# EAGLE design lit-bit (EAGLE 9.0.1)
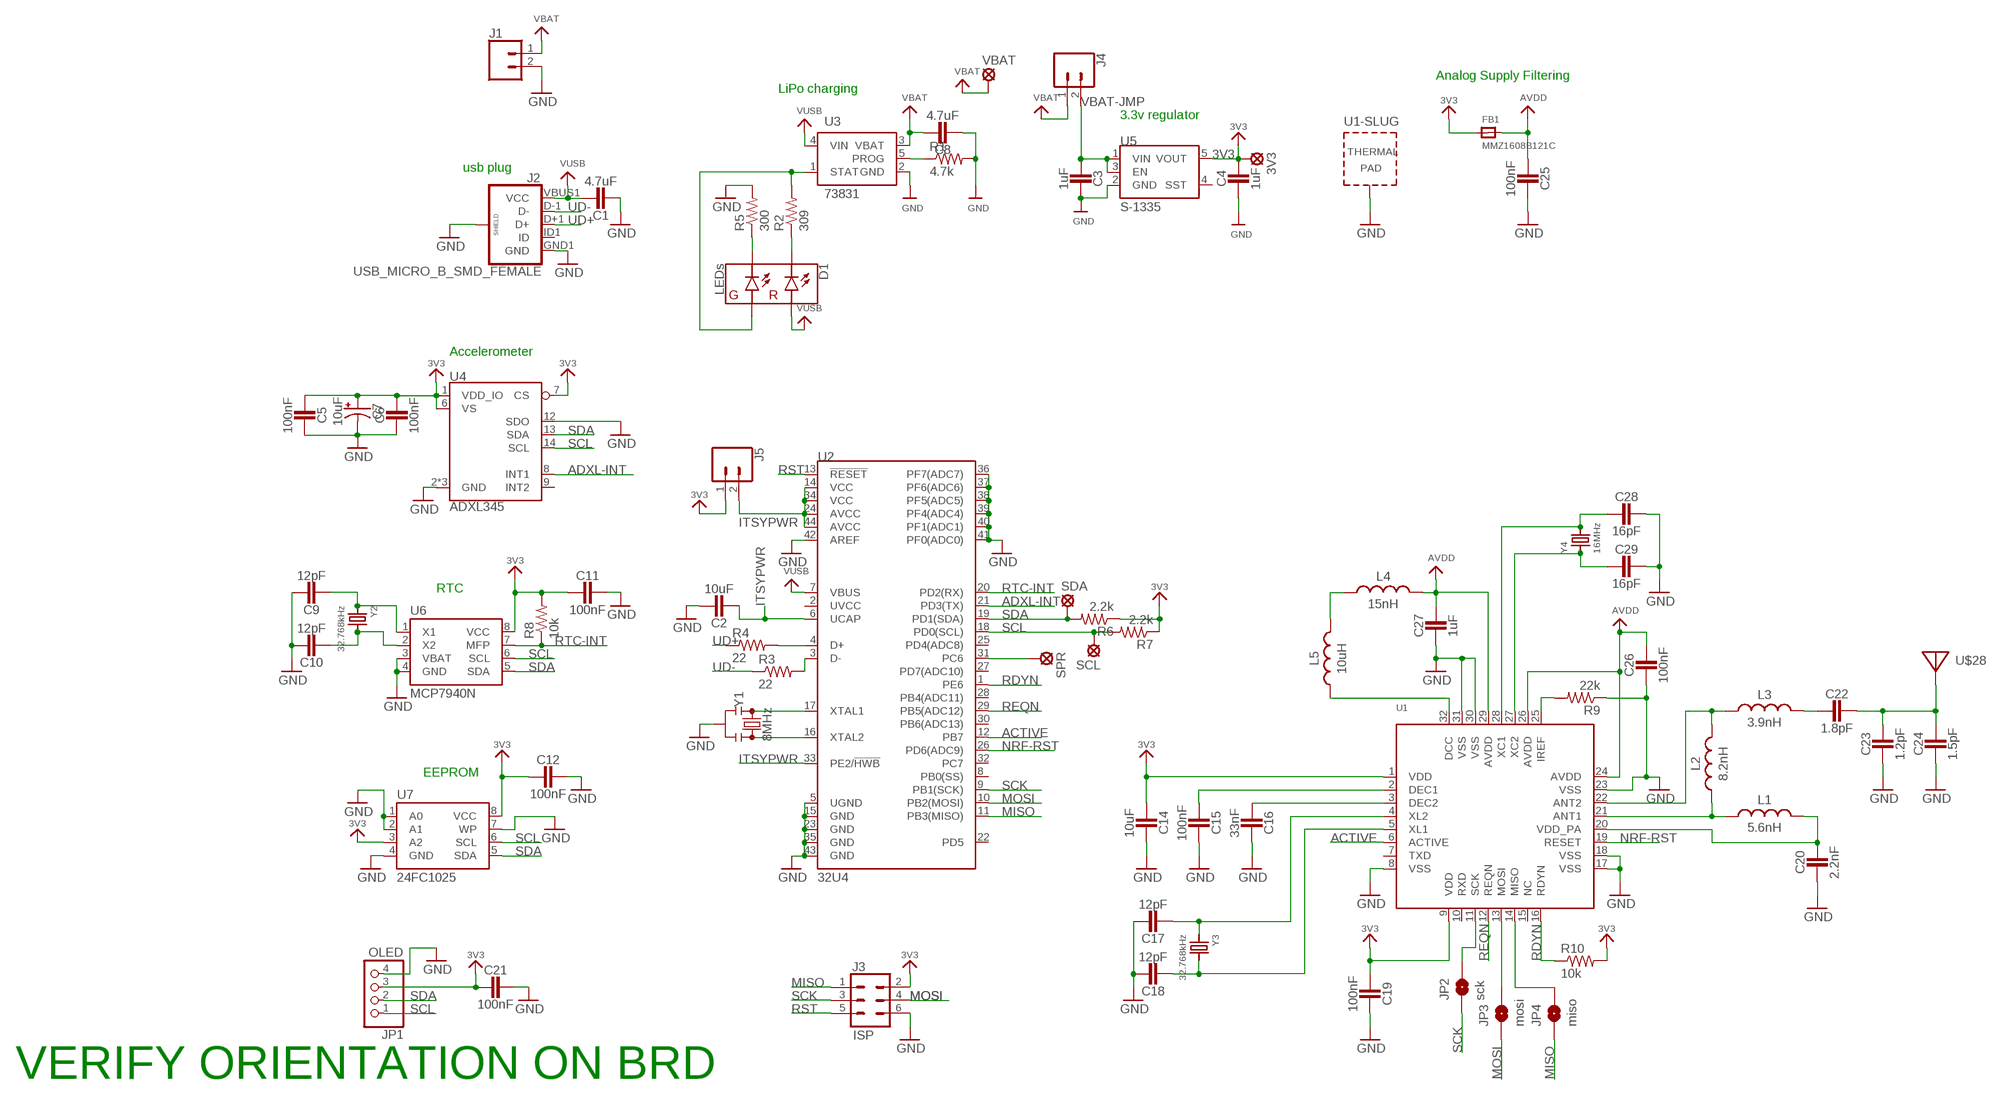
[diagram p0: schematic, sheet 1]

## Parts
3V3  LSP10  [LSP10]
C1  4.7uF  CAP_NONPOL0603  [0603]
C2  10uF  CAP_NONPOL0603  [0603]
C3  1uF  CAP_NONPOL0603  [0603]
C4  1uF  CAP_NONPOL0603  [0603]
C5  100nF  CAP_NONPOL0603  [0603]
C6  100nF  CAP_NONPOL0603  [0603]
C7  10uF  CAP_POL  [0805-POLAR]
C8  4.7uF  CAP_NONPOL0603  [0603]
C9  12pF  CAP_NONPOL0603  [0603]
C10  12pF  CAP_NONPOL0603  [0603]
C11  100nF  CAP_NONPOL0603  [0603]
C12  100nF  CAP_NONPOL0603  [0603]
C14  10uF  CAP_NONPOL0603  [0603]
C15  100nF  CAP_NONPOL0603  [0603]
C16  33nF  CAP_NONPOL0603  [0603]
C17  12pF  CAP_NONPOL0603  [0603]
C18  12pF  CAP_NONPOL0603  [0603]
C19  100nF  CAP_NONPOL0603  [0603]
C20  2.2nF  CAP_NONPOL0603  [0603]
C21  100nF  CAP_NONPOL0603  [0603]
C22  1.8pF  CAP_NONPOL0603  [0603]
C23  1.2pF  CAP_NONPOL0603  [0603]
C24  1.5pF  CAP_NONPOL0603  [0603]
C25  100nF  CAP_NONPOL0603  [0603]
C26  100nF  CAP_NONPOL0603  [0603]
C27  1uF  CAP_NONPOL0603  [0603]
C28  16pF  CAP_NONPOL0603  [0603]
C29  16pF  CAP_NONPOL0603  [0603]
D1  LEDs  LED-RGSMIT  [0606]
FB1  MMZ1608B121C  FERRITE0805  [0805]
J1  CONN_02-JST-2MM-SMT  [JST-2-SMD]
J2  USB_MICRO_B_SMD_FEMALE  [USB-B-MICRO-SMD]
J3  ISP  CONN_03X22X3_SILK_MALE_PTH  [2X3]
J4  CONN_02  [1X02]
J5  CONN_02  [1X02]
JP1  OLED  HEADER-1X4ROUND  [1X04_ROUND]
JP2  sck  JUMPER-SMT_2_NO_SILK  [SMT-JUMPER_2_NO_SILK]
JP3  mosi  JUMPER-SMT_2_NO_SILK  [SMT-JUMPER_2_NO_SILK]
JP4  miso  JUMPER-SMT_2_NO_SILK  [SMT-JUMPER_2_NO_SILK]
L1  5.6nH  INDUCTOR0603  [0603]
L2  8.2nH  INDUCTOR0603  [0603]
L3  3.9nH  INDUCTOR0603  [0603]
L4  15nH  INDUCTOR0603  [0603]
L5  10uH  INDUCTOR0603  [0603]
R1  4.7k  RES-0603  [0603]
R2  309  RES-0603  [0603]
R3  22  RES-0603  [0603]
R4  22  RES-0603  [0603]
R5  300  RES-0603  [0603]
R6  2.2k  RES-0603  [0603]
R7  2.2k  RES-0603  [0603]
R8  10k  RES-0603  [0603]
R9  22k  RES-0603  [0603]
R10  10k  RES-0603  [0603]
SCL  LSP10  [LSP10]
SDA  LSP10  [LSP10]
SPR  LSP10  [LSP10]
U1  NRF8001  [QFN32_5MM]
U2  32U4  ATMEGA32U4TQFP-44  [TQFP44]
U3  73831  MCP73831T  [SOT23-5]
U4  ADXL345  [LGA-14]
U5  S-1335  S-1335M33  [SOT23-5]
U6  MCP7940N  [8-SOIC_HAND_SOLDER]
U7  24FC1025  [8-SOIC_HAND_SOLDER]
U$28  ANTENNA_PCBNRF8001_1.6MM  [ANT_PCB_2.4GHZ_NRF8001_1.6MM_1OZ]
VBAT  LSP10  [LSP10]
Y1  8MHz  RESONATOR-8MHZSMD_3.2X1.3  [RESONATOR-SMD-3.2X1.3]
Y2  32.768kHz  CRYSTAL8X3.8SMT  [CRYSTAL_8X3.8]
Y3  32.768kHz  CRYSTAL8X3.8SMT  [CRYSTAL_8X3.8]
Y4  16MHz  CRYSTALTHIN  [CRYSTAL_3.2X2.5]

## Nets
3V3: 3V3.MP C4.1 C5.2 C6.1 C7.1(+) C11.2 C12.2 C14.2 C19.2 C21.2 FB1.1 J3.2 J5.1 JP1.3 R6.1 R7.1 R8.2 R10.2 U1.1(VDD) U1.9(VDD) U4.1(VDD_IO) U4.6(VS) U4.7(CS) U5.5(VOUT) U6.8(VCC) U7.3(A2) U7.8(VCC)
ACTIVE: U1.6(ACTIVE) U2.12(PB7)
ADXL-INT: U2.21(PD3(TX)) U4.8(INT1)
AVDD: C25.2 C26.1 C27.1 FB1.2 L4.2 U1.24(AVDD) U1.26(AVDD) U1.29(AVDD)
D+: R4.2 U2.4(D+)
GND: C1.2 C2.1 C3.1 C4.2 C5.1 C6.2 C7.2(-) C8.2 C9.1 C10.1 C11.1 C12.1 C14.1 C15.1 C16.1 C17.1 C18.1 C19.1 C20.2 C21.1 C23.2 C24.2 C25.1 C26.2 C27.2 C28.1 C29.1 J1.2 J2.GND1(GND) J2.P$1(SHIELD) J2.P$3(SHIELD) J2.P$4(SHIELD) J2.P$5(SHIELD) J3.6 JP1.4 R1.2 R5.2 R9.1 U1.8(VSS) U1.17(VSS) U1.18(VSS) U1.23(VSS) U1.30(VSS) U1.31(VSS) U1.33(TP) U2.5(UGND) U2.15(GND) U2.23(GND) U2.35(GND) U2.36(PF7(ADC7)) U2.37(PF6(ADC6)) U2.38(PF5(ADC5)) U2.39(PF4(ADC4)) U2.40(PF1(ADC1)) U2.41(PF0(ADC0)) U2.42(AREF) U2.43(GND) U3.2(GND) U4.2(GND) U4.4(GND) U4.5(GND) U4.12(SDO) U5.2(GND) U6.3(VBAT) U6.4(GND) U7.1(A0) U7.2(A1) U7.4(GND) U7.7(WP) Y1.2
ITSYPWR [3v3]: C2.2 J5.2 U2.6(UCAP) U2.14(VCC) U2.24(AVCC) U2.33(PE2/!HWB) U2.34(VCC) U2.44(AVCC)
MISO: J3.1 JP4.1 U2.11(PB3(MISO))
MOSI: J3.4 JP3.1 U2.10(PB2(MOSI))
N$1: U2.17(XTAL1) Y1.1
N$2: R1.1 U3.5(PROG)
N$3: D1.P$3(GA) R2.2 U3.1(STAT)
N$4: D1.P$2(RC) R2.1
N$5: D1.P$4(GC) R5.1
N$6: R3.2 U2.3(D-)
N$7: U2.16(XTAL2) Y1.3
N$9: SPR.MP U2.31(PC6)
N$15: C17.2 U1.4(XL2) Y3.P$1
N$16: C15.2 U1.2(DEC1)
N$20: C9.2 U6.1(X1) Y2.P$1
N$21: C10.2 U6.2(X2) Y2.P$4
N$22: C16.2 U1.3(DEC2)
N$23: C18.2 U1.5(XL1) Y3.P$4
N$24: C20.1 L1.2 U1.20(VDD_PA)
N$25: L1.1 L2.1 U1.21(ANT1)
N$27: JP2.2 U1.11(SCK)
N$28: L2.2 L3.1 U1.22(ANT2)
N$29: JP3.2 U1.13(MOSI)
N$30: R9.2 U1.25(IREF)
N$31: C22.2 L3.2
N$32: C22.1 C23.1 C24.1 U$28.FEED
N$33: C28.2 U1.28(XC1) Y4.2
N$34: JP4.2 U1.14(MISO)
N$35: L4.1 L5.2
N$36: L5.1 U1.32(DCC)
N$37: C29.2 U1.27(XC2) Y4.1
NRF-RST: U1.19(RESET) U2.26(PD6(ADC9))
RDYN: R10.1 U1.16(RDYN) U2.1(PE6)
REQN: U1.12(REQN) U2.29(PB5(ADC12))
RST: J3.5 U2.13(!RESET)
RTC-INT: R8.1 U2.20(PD2(RX)) U6.7(MFP)
SCK: J3.3 JP2.1 U2.9(PB1(SCK))
SCL: JP1.1 R7.2 SCL.MP U2.18(PD0(SCL)) U4.14(SCL) U6.6(SCL) U7.6(SCL)
SDA: JP1.2 R6.2 SDA.MP U2.19(PD1(SDA)) U4.13(SDA) U6.5(SDA) U7.5(SDA)
UD+: J2.D+1(D+) R4.1
UD-: J2.D-1(D-) R3.1
VBAT [VBAT]: C8.1 J1.1 J4.1 U3.3(VBAT) VBAT.MP
VBAT-JMP [VBAT]: C3.2 J4.2 U5.1(VIN) U5.3(EN)
VUSB: C1.1 D1.P$1(RA) J2.VBUS1(VCC) U2.7(VBUS) U3.4(VIN)
Unconnected: J2.ID1(ID) U1.7(TXD) U1.10(RXD) U1.15(NC) U2.2(UVCC) U2.8(PB0(SS)) U2.22(PD5) U2.25(PD4(ADC8)) U2.27(PD7(ADC10)) U2.28(PB4(ADC11)) U2.30(PB6(ADC13)) U2.32(PC7) U4.9(INT2) U5.4(SST)

## Notes on the sheet
- Analog Supply Filtering
- LiPo charging
- 3.3v regulator
- usb plug
- Accelerometer
- RTC
- EEPROM
- VERIFY ORIENTATION ON BRD

## Library data of the parts
3V3 SCL SDA SPR VBAT = solpad:LSP10: SOLDER PAD drill 1.0 mm, distributor Buerklin, 12H555
C1-C6 C8-C12 C14-C29 = SCADA_CUSTOM_LIBRARY:CAP_NONPOL
C7 = SCADA_CUSTOM_LIBRARY:CAP_POL
D1 = SCADA_CUSTOM_LIBRARY:LED-RG: LiteOn Technology Corporation LTST-C195KGJRKT - LED GREEN/RED CLEAR 0606 SMD Color: Red/Green Lens Transparency: Clear Lens Style/Size: Rectangle with Flat top, 1.10 x 1.5 mm mC Rating45mcd Red, 35 mcd Green Current: 20mA Red, 20mA Green Forward Voltage: 2V Red, 2V Green Packages: 0606 SparkFun Products: Electric Imp imp002 Breakout <[https://www.sparkfun.com/products/12958]>; PROD_ID: DIO-12140
FB1 = microbuilder:FERRITE: Ferrite Bead 0603 MMZ1608B121C - 120 Ohm @ 100MHz, 600mA, 0.15 Ohm DC Resistance - Digikey: 445-2164-1-ND BK1608HW121-T - 120 Ohm, 600mA Ferrite Chip - Digikey: 587-1876-2-ND 0805 HZ0805B272R-10 - 2.7K Ohm @ 100MHz, 200mA, 0.8 Ohm DC Resistance - Digikey: 240-2504-1-ND (see also Murata BLM21BD272SN1L) MMZ2012Y152B - 1.5K Ohm @ 100MHz, 500mA, 0.4 Ohm DC Resistance - Digikey: 445-1560-1-ND - Mainly for high frequency (80-400MHz) MMZ2012R102A - 1K Ohm @ 100MHz, 500mA, 0.3 Ohm DC Resistance - Digikey: 445-1555-2-ND - More general purpose (10-200MHz)
J1 = SparkFun-Connectors:CONN_02: Multi connection point. Often used as Generic Header-pin footprint for 0.1 inch spaced/style header connections On any of the 0.1 inch spaced packages, you can populate with these: Break Away Headers - Straight <https://www.sparkfun.com/products/116> (PRT-00116) Break Away Male Headers - Right Angle <https://www.sparkfun.com/products/553> (PRT-00553) Female Headers <https://www.sparkfun.com/products/115> (PRT-00115) Break Away Headers - Machine Pin <https://www.sparkfun.com/products/117> (PRT-00117) Break Away Female Headers - Swiss Machine Pin <https://www.sparkfun.com/products/743> (PRT-00743) For SCREWTERMINALS and SPRING TERMINALS visit here: Screw Terimnals on SparkFun.com <https://www.sparkfun.com/search/results?term=Screw+Terminals> (5mm/3.5mm/2.54mm spacing) This device is also useful as a general connection point to wire up your design to another part of your project. Our various solder wires solder well into these plated through hole pads. Hook-Up Wire - Assortment (Stranded, 22 AWG) <https://www.sparkfun.com/products/11375> (PRT-11375) Hook-Up Wire - Assortment (Solid Core, 22 AWG) <https://www.sparkfun.com/products/11367> (PRT-11367) View the entire wire category on our website here <https://www.sparkfun.com/categories/141> Special notes: Molex polarized connector foot print use with: PRT-08233 with associated crimp pins and housings. 2.54_SCREWTERM for use with PRT-10571. 3.5mm Screw Terminal footprints for PRT-08084 5mm Screw Terminal footprints for use with PRT-08432; PROD_ID: CONN-11443
J2 = SCADA_CUSTOM_LIBRARY:USB_MICRO_B_SMD_FEMALE
J3 = SCADA_CUSTOM_LIBRARY:CONN_03X2: Multi connection point. Often used as Generic Header-pin footprint for 0.1 inch spaced/style header connections You can populate with any combo of single row headers, but if you'd like an exact match, check these: Header - 2x3 (Male, 0.1") <https://www.sparkfun.com/products/12807> (PRT-12807) Header - 2x3 (Female, 0.1") <https://www.sparkfun.com/products/13010> (PRT-13010) 2x3 Pin Shrouded Header <https://www.sparkfun.com/products/10877> (PRT-10877) On any of the 0.1 inch spaced packages, you can populate with these: Break Away Headers - Straight <https://www.sparkfun.com/products/116> (PRT-00116) Break Away Male Headers - Right Angle <https://www.sparkfun.com/products/553> (PRT-00553) Female Headers <https://www.sparkfun.com/products/115> (PRT-00115) Break Away Headers - Machine Pin <https://www.sparkfun.com/products/117> (PRT-00117) Break Away Female Headers - Swiss Machine Pin <https://www.sparkfun.com/products/743> (PRT-00743) Special note: the shrouded connector mates well with our 3x2 ribbon cables: Ribbon Crimp Connector - 6-pin (2x3, Female) <https://www.sparkfun.com/products/10651> (PRT-10651) Ribbon Cable - 6 wire (15ft) <https://www.sparkfun.com/products/10646> (PRT-10646); PROD_ID: CONN-09701
J4 J5 = SparkFun-Connectors:CONN_02: Multi connection point. Often used as Generic Header-pin footprint for 0.1 inch spaced/style header connections On any of the 0.1 inch spaced packages, you can populate with these: Break Away Headers - Straight <https://www.sparkfun.com/products/116> (PRT-00116) Break Away Male Headers - Right Angle <https://www.sparkfun.com/products/553> (PRT-00553) Female Headers <https://www.sparkfun.com/products/115> (PRT-00115) Break Away Headers - Machine Pin <https://www.sparkfun.com/products/117> (PRT-00117) Break Away Female Headers - Swiss Machine Pin <https://www.sparkfun.com/products/743> (PRT-00743) For SCREWTERMINALS and SPRING TERMINALS visit here: Screw Terimnals on SparkFun.com <https://www.sparkfun.com/search/results?term=Screw+Terminals> (5mm/3.5mm/2.54mm spacing) This device is also useful as a general connection point to wire up your design to another part of your project. Our various solder wires solder well into these plated through hole pads. Hook-Up Wire - Assortment (Stranded, 22 AWG) <https://www.sparkfun.com/products/11375> (PRT-11375) Hook-Up Wire - Assortment (Solid Core, 22 AWG) <https://www.sparkfun.com/products/11367> (PRT-11367) View the entire wire category on our website here <https://www.sparkfun.com/categories/141> Special notes: Molex polarized connector foot print use with: PRT-08233 with associated crimp pins and housings. 2.54_SCREWTERM for use with PRT-10571. 3.5mm Screw Terminal footprints for PRT-08084 5mm Screw Terminal footprints for use with PRT-08432
JP1 = microbuilder:HEADER-1X4: PIN HEADER
JP2-JP4 = SparkFun-Jumpers:JUMPER-SMT_2_NO: Normally open jumper This jumper has two pads in close proximity to each other. Apply solder to close the connection. Round pads are easier to solder for beginners, but are a lot larger. SparkFun Product that uses the round pads: SparkFun EL Sequencer <https://www.sparkfun.com/products/12781>
L1-L5 = SCADA_CUSTOM_LIBRARY:INDUCTOR
R1-R10 = SCADA_CUSTOM_LIBRARY:RES-0603
U1 = SCADA_CUSTOM_LIBRARY:NRF8001: nRF8001 - Bluetooth Low-Energy Transceiver VDD: 1.9-3.6V Temp: -40°C - 85°C
U2 = SCADA_CUSTOM_LIBRARY:ATMEGA32U4: Atmel MCU, 32KByte Atmel 44-pin 8-bit Microcontroller with 32KBytes of ISP Flash and USB Controller Datasheet <http://cdn.sparkfun.com/datasheets/Dev/Arduino/Boards/ATMega32U4.pdf> SparkFun Products LilyPad Arduino USB - ATmega32U4 Board <https://www.sparkfun.com/products/12049> (DEV-12049) Pro Micro - 5V/16MHz <https://www.sparkfun.com/products/12640> (DEV-12640) Pro Micro - 3.3V/8MHz <https://www.sparkfun.com/products/12587> (DEV-12587) Fio v3 - ATmega32U4 <https://www.sparkfun.com/products/11520> (DEV-11520) Qduino Mini <https://www.sparkfun.com/products/13614> (DEV-13614) Makey Makey - Standard Kit <https://www.sparkfun.com/products/11511> (WIG-11511) Makey Makey Deluxe Kit <https://www.sparkfun.com/products/11519> (WIG-11519); PROD_ID: IC-11161
U3 = SCADA_CUSTOM_LIBRARY:MCP73831T
U4 = SCADA_CUSTOM_LIBRARY:ADXL345: Analog Devices ADXL345 3-Axis SPI/I2C 2/4/8/16g Accelerometer The ADXL345 is a small, thin, low power, 3-axis accelerometer with high resolution (13-bit) measurement at up to ±16g. Digital output data is formatted as 16-bit twos complement and is accessible through either a SPI (3- or 4-wire) or I2C digital interface. Datasheet <https://www.sparkfun.com/datasheets/Sensors/Accelerometer/ADXL345.pdf> SparkFun Products SparkFun Triple Axis Accelerometer Breakout - ADXL345 <https://www.sparkfun.com/products/9836> (SEN-09836) Triple Axis Accelerometer - ADXL345 <https://www.sparkfun.com/products/9045> (SEN-09045) SparkFun 6 Degrees of Freedom IMU Digital Combo Board - ITG3200/ADXL345 <https://www.sparkfun.com/products/10121> (SEN-10121); PROD_ID: IC-09097; SF_ID: SEN-09045
U5 = SCADA_CUSTOM_LIBRARY:S-1335M33
U6 = SCADA_CUSTOM_LIBRARY:MCP7940N: RTC Battery-Backed I2C Real-Time Clock/Calendar with SRAM
U7 = SCADA_CUSTOM_LIBRARY:24FC1025
U$28 = microbuilder:ANTENNA_PCB: Various pre-calculated PCB Antennas NRF8001 1.6mm 1Oz - 2.4GHz PCB antenna for 1.6mm PCBs with 1oz copper, double-sided boards (no GND plan beneath antenna). See nRF2740 production files for further information and impedance matching network. 868MHz/2.4GHz DUALBAND - Dual 868MHz and 2.4GHz centered antenna based on board #6 of the CC-ANTENNA-DK from Chipcon/TI
Y1 = SCADA_CUSTOM_LIBRARY:RESONATOR-8MHZ: 8MHz Resonator Digikey Example <http://www.digikey.com/product-detail/en/murata-electronics-north-america/CSTCE10M0G55-R0/490-1196-1-ND/584633> Frequency: 8MHz Frequency Stability: ±0.2% Frequency Tolerance: ±0.5% Capacitance: 33pF SparkFun Products Arduino Pro Mini 328- 3.3V/8MHz <https://www.sparkfun.com/products/11114> SparkFun Digital Sandbox <https://www.sparkfun.com/products/12651>; PROD_ID: XTAL-08895
Y2-Y4 = SCADA_CUSTOM_LIBRARY:CRYSTAL: Crystals HC49UP - Surface Mount Crystal 4.0MHz 18pF +/-30ppm Surface Mount Crystal [Digikey: 535-9857-1-ND] 12.0 MHz Surface Mount Crystal [Digikey: 535-9869-6-ND] 25.0 MHz Surface Mount Crystal [Digikey: 535-9078-1-ND] 2.5 x 2.0mm - MEMs SMT Crystal 16.0 MHz 10pF 20ppm 2.5 x 2.0mm Crystal [Digikey -40-85°C: 535-10923-1-ND] 3.2 x 2.5mm - MEMs SMT Crystal 12.0 MHz 8pF 15ppm 3.2 x 2.5mm Crystal [Digikey: -10-70°C: 644-1047-1-ND -40-125°C: 644-1128-1-ND] 16.0 MHz 8pF 15ppm 3.2 x 2.5mm Crystal [Digikey: -10-70°C: 644-1049-1-ND -40-125°C: 644-1129-2-ND] 16.0 MHz 10pF 10ppm 3.2 x 2.5mm Crystal [Digikey: 644-1100-1-ND] 27.12 MHz 18pF 30ppm 3.2 x 2.5mm Crystal [Digikey: 887-1424-1-ND] 27.12MHz 10pF 10ppm 3.2 x 2.5mm Crystal [Digikey: 887-1329-1-ND] 4.9 x 1.8mm - MEMs SMT Crystal 32.768 KHz 12.5pF 20ppm 4.9 x 1.8mm Crystal [Digikey: SE2415CT-ND] 8.0 x 3.8mm - Surface Mount Crystal 32.768kHz 12.5pF 20ppm -40°C-85°C [Digikey: 535-9166-2-ND] Cylinder 32.768KHz Cylinder Crystal (2x6mm body) [Ex. Digikey: 300-8341-2-ND]

## Net classes
0 default: width 0.203 mm, clearance 0.205 mm
1 VBAT: width 0.381 mm, clearance 0.203 mm
2 3v3: width 0.381 mm

## Board
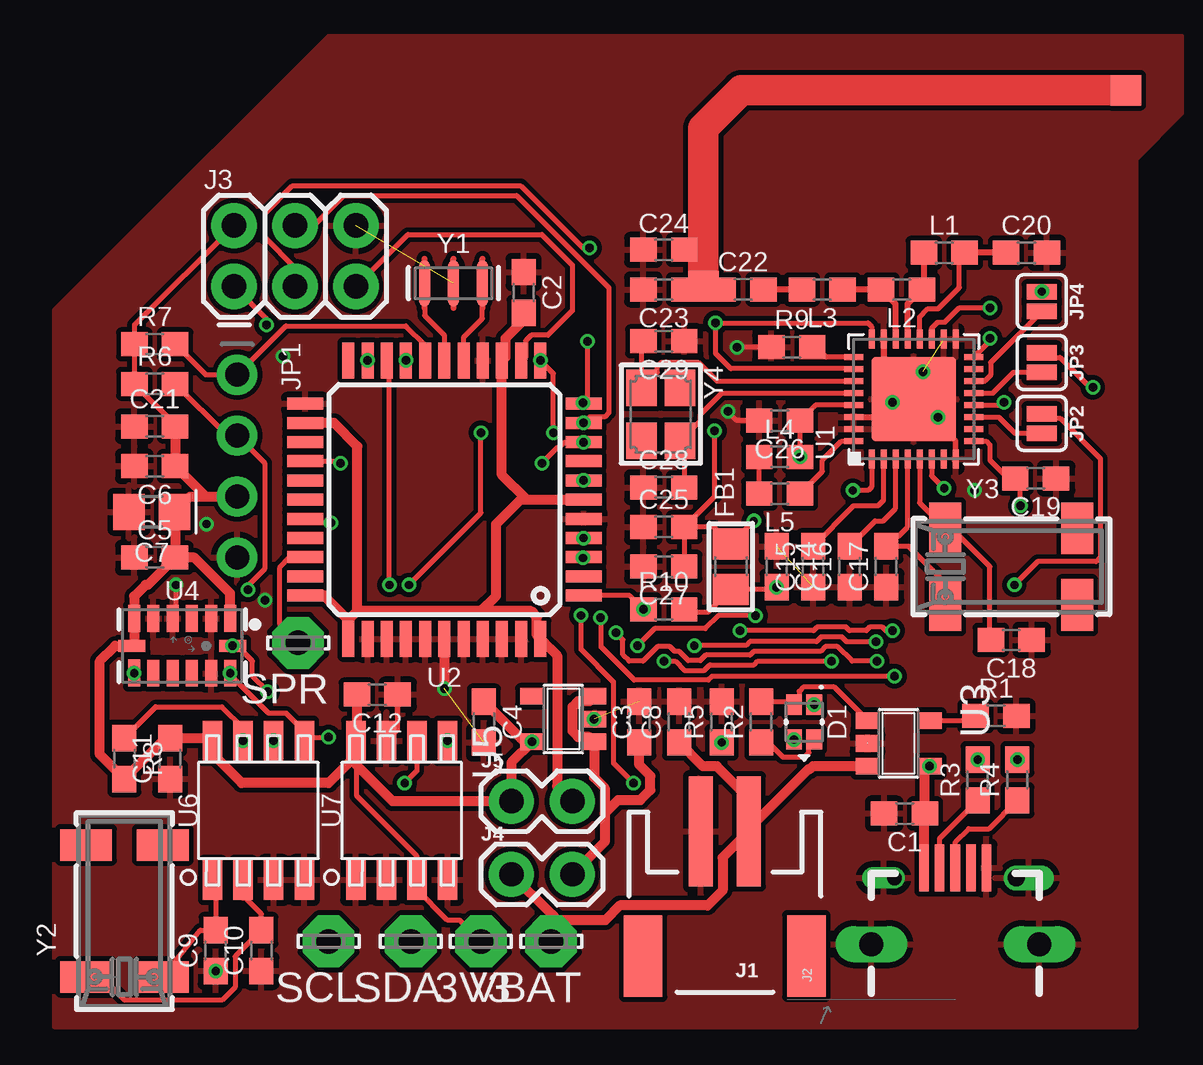
[diagram p1: board, top side]
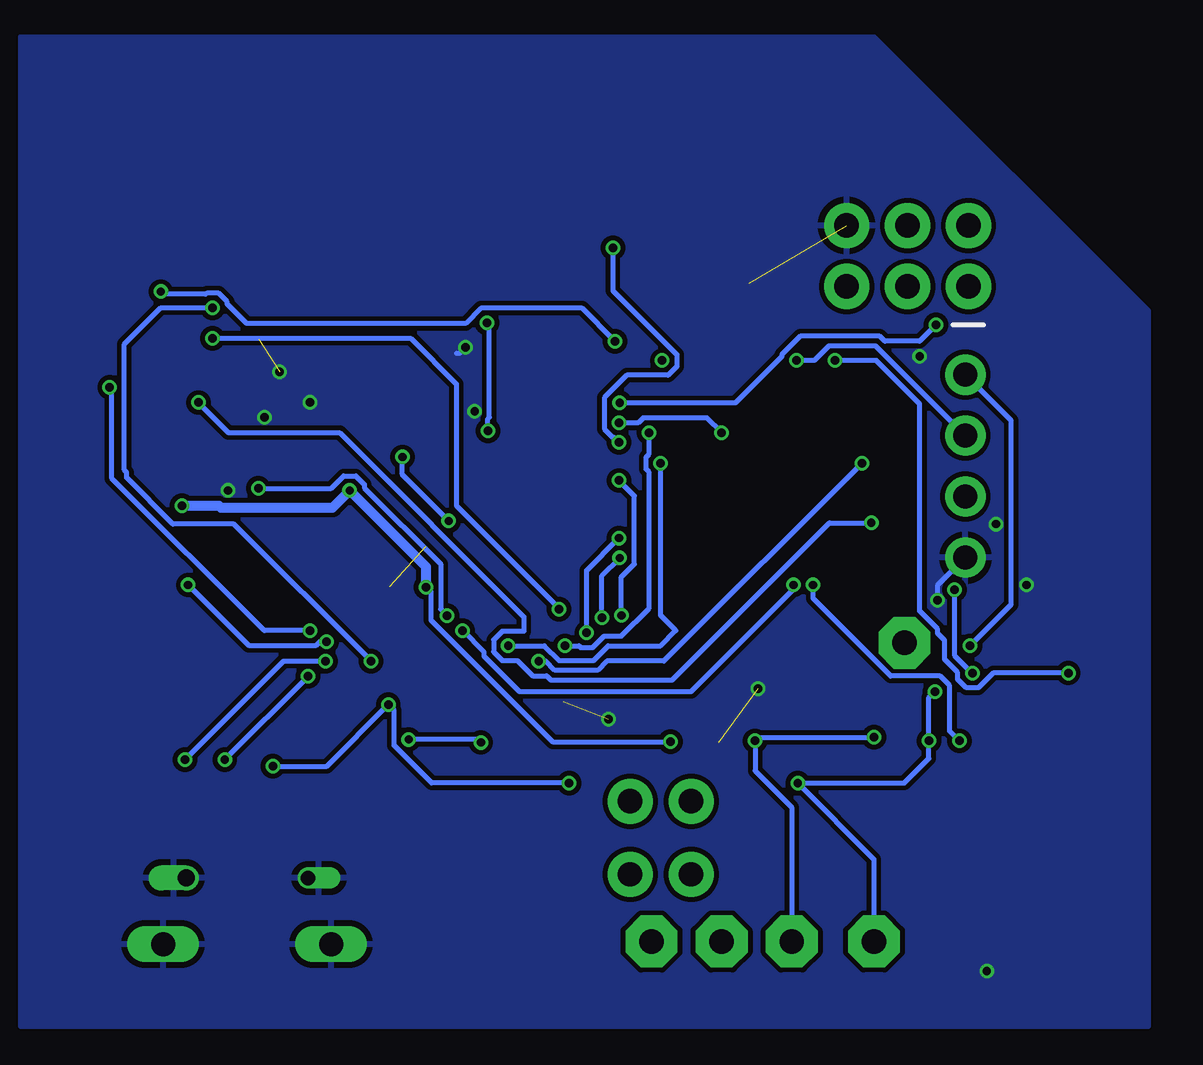
[diagram p2: board, bottom side, seen from below]

No outline drawn. Coordinates in mm, seen from the top.
Copper layers (1*16): Top 0.035559375mm / dielectric 1.6mm / Bottom 0.035559375mm
Design rules "oshpark-2layer *": minimum track width 6mil, minimum drill 10mil, track to track 6mil, track to pad 6mil, pad to pad 6mil, via to via 6mil, smd to smd 0mil, copper to edge 15mil, drill to drill 6mil, minimum pad ring 5mil, minimum via ring 5mil, stop-mask expansion 2.5mil, vias tented up to drill 0mil, thermal gap 10mil

### Footprints (pad centres in the part's own frame; a part is rotated, then mirrored left to right if it is on the bottom)
LSP10 = drill 1.016 pad 2.159 octagon: MP 0,0
0603 = smd 1.1 x 1: 1 -0.85,0; 2 0.85,0
0805-POLAR = smd 1.3 x 1.5: 1 -0.95,0; 2 0.95,0
0606 = smd 0.85 x 0.65: P$1 -0.725,0.425; P$2 0.725,0.425; P$3 -0.725,-0.425; P$4 0.725,-0.425
0805 = smd 1.3 x 1.5: 1 -0.95,0; 2 0.95,0
JST-2-SMD = smd 1 x 4.6: 1 -1,-3.7; 2 1,-3.7 | smd 1.6 x 3.4: NC1 -3.4,1.5; NC2 3.4,1.5
USB-B-MICRO-SMD = smd 1.958 x 0.4: D+1 5.345,3.73; D-1 5.345,4.38; GND1 5.345,2.43; ID1 5.345,3.08; VBUS1 5.345,5.03 | drill 1 pad 1.5 long: P$1 2.17,0.23; P$3 2.17,7.23 | drill 0.6 offset: P$4 4.93,6.27 | drill 0.7 offset: P$5 4.93,1.19
2X3 = drill 1.016 pad 1.88: 1 0,0; 2 0,2.54; 3 2.54,0; 4 2.54,2.54; 5 5.08,0; 6 5.08,2.54
1X02 = drill 1.016 pad 1.88: 1 0,0; 2 2.54,0
1X04_ROUND = drill 1 pad 1.676: 1 -3.81,0; 2 -1.27,0; 3 1.27,0; 4 3.81,0
SMT-JUMPER_2_NO_SILK = smd 0.635 x 1.27: 1 -0.406,0; 2 0.406,0
QFN32_5MM = smd 0.8 x 0.25: 1 -2.5,1.75; 2 -2.5,1.25; 3 -2.5,0.75; 4 -2.5,0.25; 5 -2.5,-0.25; 6 -2.5,-0.75; 7 -2.5,-1.25; 8 -2.5,-1.75; 17 2.5,-1.75; 18 2.5,-1.25; 19 2.5,-0.75; 20 2.5,-0.25; 21 2.5,0.25; 22 2.5,0.75; 23 2.5,1.25; 24 2.5,1.75 | smd 0.25 x 0.8: 9 -1.75,-2.5; 10 -1.25,-2.5; 11 -0.75,-2.5; 12 -0.25,-2.5; 13 0.25,-2.5; 14 0.75,-2.5; 15 1.25,-2.5; 16 1.75,-2.5; 25 1.75,2.5; 26 1.25,2.5; 27 0.75,2.5; 28 0.25,2.5; 29 -0.25,2.5; 30 -0.75,2.5; 31 -1.25,2.5; 32 -1.75,2.5 | smd 3.5 x 3.5: 33 0,0
TQFP44 = smd 1.5 x 0.5: 1 -5.8,4; 2 -5.8,3.2; 3 -5.8,2.4; 4 -5.8,1.6; 5 -5.8,0.8; 6 -5.8,0; 7 -5.8,-0.8; 8 -5.8,-1.6; 9 -5.8,-2.4; 10 -5.8,-3.2; 11 -5.8,-4; 23 5.8,-4; 24 5.8,-3.2; 25 5.8,-2.4; 26 5.8,-1.6; 27 5.8,-0.8; 28 5.8,0; 29 5.8,0.8; 30 5.8,1.6; 31 5.8,2.4; 32 5.8,3.2; 33 5.8,4 | smd 0.5 x 1.5: 12 -4,-5.8; 13 -3.2,-5.8; 14 -2.4,-5.8; 15 -1.6,-5.8; 16 -0.8,-5.8; 17 0,-5.8; 18 0.8,-5.8; 19 1.6,-5.8; 20 2.4,-5.8; 21 3.2,-5.8; 22 4,-5.8; 34 4,5.8; 35 3.2,5.8; 36 2.4,5.8; 37 1.6,5.8; 38 0.8,5.8; 39 0,5.8; 40 -0.8,5.8; 41 -1.6,5.8; 42 -2.4,5.8; 43 -3.2,5.8; 44 -4,5.8
SOT23-5 = smd 0.69 x 0.99: 1 -0.95,-1.29; 2 0,-1.29; 3 0.95,-1.29; 4 0.95,1.3; 5 -0.95,1.3
LGA-14 = smd 0.5 x 1.124: 1 2,1.138; 2 1.2,1.138; 3 0.4,1.138; 4 -0.4,1.138; 5 -1.2,1.138; 6 -2,1.138; 8 -2,-1.13; 9 -1.2,-1.138; 10 -0.4,-1.138; 11 0.4,-1.138; 12 1.2,-1.138; 13 2,-1.138 | smd 1.124 x 0.5: 7 -2.1,0; 14 2.1,0
8-SOIC_HAND_SOLDER = smd 1.676 x 0.813: 1 -2.9,1.91; 2 -2.9,0.64; 3 -2.9,-0.63; 4 -2.9,-1.91; 5 2.9,-1.91; 6 2.9,-0.63; 7 2.9,0.64; 8 2.9,1.91
ANT_PCB_2.4GHZ_NRF8001_1.6MM_1OZ = smd 1.27 x 1.27: FEED 0,0; TESTPOINT -8.169,17.605
RESONATOR-SMD-3.2X1.3 = smd 0.45 x 1.905: 1 -1.2,0; 2 0,0; 3 1.2,0
CRYSTAL_8X3.8 = smd 1.321 x 2.159: P$1 -2.75,-1.6; P$2 2.75,-1.6; P$3 2.75,1.6; P$4 -2.75,1.6
CRYSTAL_3.2X2.5 = smd 1.524 x 1.27: 1 -1.1,-0.8; 2 1.1,0.8; GND1 -1.1,0.8; GND2 1.1,-0.8

### Placement (x,y rotation side)
3V3  17.78,3.56 180 top
C1  35.43,8.89 180 top
C2  19.56,30.61 270 top
C3  24.38,12.7 270 top
C4  17.91,12.7 270 top
C5  4.19,19.56 0 top
C6  4.19,23.37 180 top
C7  4.06,21.46 180 top
C8  26.04,12.7 90 top
C9  6.73,3.17 90 top
C10  8.64,3.17 90 top
C11  4.83,11.18 90 top
C12  13.46,13.84 180 top
C14  30.1,19.18 270 top
C15  31.62,19.18 90 top
C16  33.15,19.18 90 top
C17  34.67,19.18 90 top
C18  39.88,16.13 180 top
C19  40.89,22.86 180 top
C20  40.51,32.26 0 top
C21  4.19,25.02 0 top
C22  28.7,30.73 0 top
C23  25.4,30.73 180 top
C24  25.4,32.38 180 top
C25  25.4,20.83 0 top
C26  30.23,25.27 180 top
C27  25.4,19.18 180 top
C28  25.4,22.48 0 top
C29  25.4,28.57 180 top
D1  31.24,12.7 270 top
FB1  28.19,19.18 90 top
J1  27.94,4.45 180 top
J2  41.27,1.27 90 top
J3  7.49,30.86 0 top
J4  19.05,6.35 0 top
J5  19.05,9.4 0 top
JP1  7.62,23.37 270 top
JP2  41.15,25.15 270 top
JP3  41.15,27.69 270 top
JP4  41.15,30.23 270 top
L1  37.08,32.26 0 top
L2  35.31,30.73 180 top
L3  32,30.73 180 top
L4  30.23,23.75 0 top
L5  30.23,22.23 180 top
R1  39.24,12.95 0 top
R2  29.46,12.7 90 top
R3  38.48,10.29 90 top
R4  40.13,10.29 90 top
R5  27.81,12.7 90 top
R6  4.19,26.8 0 top
R7  4.19,28.45 0 top
R8  2.92,11.18 270 top
R9  30.73,28.32 0 top
R10  25.4,17.4 0 top
SCL  11.43,3.56 180 top
SDA  14.86,3.56 180 top
SPR  10.16,16 180 top
U1  35.81,26.16 90 top
U2  16.26,21.97 180 top
U3  35.18,11.81 270 top
U4  5.33,15.88 0 top
U5  21.21,12.83 90 top
U6  8.51,9.02 90 top
U7  14.48,9.02 90 top
U$28  27.05,30.86 270 top
VBAT  20.7,3.56 180 top
Y1  16.64,30.99 0 top
Y2  2.92,4.83 90 top
Y3  39.88,19.18 0 top
Y4  25.27,25.53 270 top

### Tracks (layer width: path | path; a pad name or v marks a point on that pad's centre or on a via)
3V3  (via drill 0.35)
  Top 0.203: U1.1 34.06,22.51 33.91,22.35 v33.27,22.35 | U1.9 38.83,24.41 38.99,24.26 38.99,23.62 39.75,22.86 C19.2 40.26,22.64 v40.26,21.72 | R10.2 26.29,17.36 26.29,17.27 27.24,17.27 FB1.1 30,18.23 C14.2 | 12.61,12.06 12.61,9.61 15.11,7.12 U7.3 15.11,5.72 16.38,4.45 16.89,4.45 3V3.MP | C21.2 5.04,25.1 R6.1 R7.1 3.34,29.25 J3.2
  Top 0.406: C21.2 C6.1 6.31,22.1 | 6.31,22.1 JP1.3 | 6.31,22.1 5.65,22.1 C7.1 5.04,21.44 C5.2 | C5.2 3.9,18.41 3.81,18.41 3.33,17.94 U4.6 3.33,15.97 U4.7 2.54,15.88 1.91,15.24 1.91,11.34 R8.2 4.62,12.03 C11.2 6.49,12.03 U6.8 6.6,11.37 7.8,10.16 11.43,10.16 12.57,11.3 U7.8 12.61,11.96 | U4.1 7.33,18.07 5.84,19.56 C5.2 | C12.2 12.61,12.06 12.61,11.96 | 12.61,11.96 12.61,10.88 14.1,9.4 J5.1 19.05,11.02 U5.5 19.58,11.88 C4.1
  Bottom 0.203: 30.1,18.41 C14.2 29.9,18.13 29.9,16.95 24.82,11.88 U5.5
  Bottom 0.406: v40.26,21.72 38.72,21.72 38.65,21.64 33.98,21.64 v33.27,22.35 30.1,19.18 30.1,18.41
  other vias: 30.1,18.33 19.91,11.88
ACTIVE  (via drill 0.35)
  Top 0.203: U1.6 36.56,22.96 v37.08,22.44 | v29.22,17.14 27.68,17.14 27.14,16.59 25.02,16.59 v24.3,15.88 | v20.8,24.77 20.8,27.23 U2.12
  Bottom 0.203: v29.22,17.14 29.49,17.41 29.49,19.29 32.66,22.46 32.66,22.6 33.02,22.96 33.53,22.96 34.05,22.44 v37.08,22.44 | v24.3,15.88 23.72,15.88 23.65,15.81 23.15,15.81 22.67,16.28 21.96,16.28 20.8,17.44 20.8,23.11 20.93,23.24 20.93,23.75 20.8,23.88 v20.8,24.77
  other vias: 20.26,27.77
ADXL-INT  (via drill 0.35)
  Bottom 0.203: U4.8 6.47,14.74 7.08,14.13 7.59,14.13 7.94,14.48 7.94,14.77 8.49,15.31 8.49,16.11 8.77,16.39 8.77,16.58 9.53,17.33 9.53,25.97 11.33,27.77 U2.21
  other vias: 3.33,14.74 13.06,27.77
AVDD  (via drill 0.35)
  Top 0.203: C25.2 C27.1 | C25.2 27.49,20.83 FB1.2 v29.15,21.08 | L4.2 C26.1 31.71,25.91 U1.29 | C25.2 27.51,22.09 v27.51,24.85 | U1.24 34.06,29.18 33.91,29.34 v27.56,29.34 27.56,28.07 28.19,27.43 33.29,27.43 U1.26
  Bottom 0.203: v27.51,24.85 27.51,25.35 27.46,25.4 27.46,29.24 v27.56,29.34 | v29.15,21.08 31.08,23.01 L4.2
  other vias: 31.08,23.75
D+  (via drill 0.35)
  Top 0.203: v23.4,16.42 23.69,16.12 23.69,15.5 23.95,15.24 24.54,15.24 25.15,15.85 25.65,15.85 25.85,15.65 26.04,15.65 26.42,15.27 26.92,15.27 27.15,15.49 29,15.49 29.15,15.65 31.93,15.65 32.13,15.85 32.64,15.85 33.25,15.24 v34.29,15.24
  Bottom 0.203: v23.4,16.42 23.4,19.02 U2.4 | R4.2 36.03,15.24 v34.29,15.24
  other vias: 40.13,11.14 22.06,20.37
GND  (via drill 0.35)  (5 unrouted)
  Top 0.203: C26.2 28.45,25.27 v28.07,25.65 | U1.8 37.56,24.41 U1.33 | R9.1 v28.45,28.32 | U4.4 5.08,17.16 v5.08,18.41 | v8.79,17.78 8.89,17.78 | U7.7 14.31,12.39 C12.1
  Top 0.254: U1.30 35.06,25.41 U1.33 34.56,27.41 U1.23
  Top 0.406: U2.39 v16.26,14.1
  Bottom 0.203: v28.07,25.65 28.19,25.53 | v28.45,28.32 28.7,28.07 28.83,28.07 | JP1.4 8.79,18.39 v8.79,17.78
  other vias: 38.35,22.35 6.73,2.33 22.5,12.83 6.35,20.95 9.53,27.94 36.2,27.3 34.92,26.04 36.83,25.4
  pour Top: 0,0 45.09,0 45.09,36.2 46.99,38.1 46.99,41.27 11.43,41.27 1.91,31.75 0,29.84
  pour Bottom: 0,0 46.99,0 46.99,41.27 11.43,41.27 0,29.84 0,29.21
ITSYPWR
  Top 0.406: U2.33 11.24,17.97 | 12.26,16.95 U2.34 | 11.24,17.97 12.26,16.95 | U2.44 20.11,16.31 20.11,17.09 19.88,17.33 17.78,17.33 | 17.78,17.33 12.64,17.33 | 12.26,16.95 12.64,17.33 | 11.24,17.98 11.24,17.97 | U2.44 20.43,16 | C2.2 19.56,29.45 18.8,28.69 18.8,27.91 U2.14 18.66,23 19.68,21.97 | U2.44 20.95,15.47 20.95,10.03 J5.2 | 17.78,17.33 18.41,17.96 18.41,20.95 19.43,21.97 19.68,21.97 | 19.68,21.97 U2.6 | 12.64,17.33 12.64,24.19 11.66,25.17 U2.24
MISO  (via drill 0.35)
  Top 0.203: J3.1 8.84,29.51 v8.84,29.26 | v22.03,26 U2.11 22.23,26.14 v22.23,28.57 | v41.15,30.64 JP4.1
  Bottom 0.203: v8.84,29.26 9.53,28.57 10.98,28.57 11.19,28.79 14.5,28.79 15.27,28.02 15.27,27.94 17.2,26 v22.03,26 | v22.23,28.57 23.6,29.95 27.81,29.95 28.45,29.31 37.57,29.31 38.38,30.12 38.38,30.22 38.74,30.58 39.24,30.58 39.29,30.53 41.03,30.53 v41.15,30.64
MOSI  (via drill 0.35)
  Top 0.203: J3.4 10.81,33.4 12.06,34.65 19.27,34.65 23.11,30.8 23.11,25.59 22.93,25.41 22.3,25.41 U2.10 | JP3.1 41.34,27.9 41.91,27.9 43.16,26.65 | 43.16,26.65 43.18,26.63 | v43.28,26.65 43.16,26.65 | v34.92,16.51 34.64,16.51 34.49,16.66 33.99,16.66 33.84,16.51 33.13,16.51 32.98,16.66 31.8,16.66 31.64,16.51 v28.57,16.51 | v14.78,18.41 17.78,21.42 v17.78,24.77
  Bottom 0.203: v34.92,16.51 36.83,16.51 43.18,22.86 43.18,26.56 v43.28,26.65 | v28.57,16.51 27.69,15.62 27.69,15.45 26.2,13.97 19.05,13.97 14.78,18.24 v14.78,18.41 | U2.10 21.25,25.17 21.05,25.37 18.39,25.37 v17.78,24.77
  other vias: 22.06,25.17
N$1
  Top 0.203: Y1.1 15.44,29.65 16.26,28.83 U2.17
N$2
  Top 0.203: U3.5 38.2,12.76 R1.1
N$3
  Top 0.203: R2.2 30.69,13.55 D1.P$3 31.04,13.64 31.04,13.98 31.21,14.16 32.49,14.16 U3.1
N$4
  Top 0.203: R2.1 29.76,11.85 30.36,11.24 31.27,11.24 31.45,11.42 31.45,11.76 D1.P$2
N$5  (via drill 0.35)
  Bottom 0.203: R5.1 27.94,11.97 D1.P$4
  other vias: 27.81,11.85 30.82,11.97
N$6  (via drill 0.35)
  Top 0.203: v22.77,17.05 22.79,17.02 22.79,15.82 24.17,14.45 27.26,14.45 27.42,14.61 v35.01,14.61 | v22.03,19.54 U2.3
  Bottom 0.203: R3.2 v35.01,14.61 | v22.77,17.05 22.77,18.8 v22.03,19.54
  other vias: 38.48,11.14
N$7
  Top 0.203: U2.16 17.06,28.74 17.84,29.52 Y1.3
N$9
  Top 0.203: SPR.MP 9.4,16.76 9.4,19.15 9.82,19.57 U2.31
N$15
  Top 0.203: Y3.P$1 37.13,18.5 35.6,20.03 C17.2 35.09,20.45 35.18,20.45 35.56,20.83 U1.4
N$16
  Top 0.203: U1.2 34.56,21.95 34.33,21.72 33.31,21.72 C15.2
N$20
  Top 0.203: Y2.P$1 6.09,4.03 C9.2 6.73,5.99 U6.1
N$21
  Top 0.203: 7.87,5.47 8.64,4.7 C10.2 7.54,2.93 7.54,1.65 7,1.11 2.93,1.11 1.97,2.08 Y2.P$4
  Top 0.406: 7.87,5.47 U6.2
N$22
  Top 0.203: C16.2 34.2,21.08 34.54,21.08 35.06,21.6 U1.3
N$23
  Top 0.203: U1.5 36.06,21.84 Y3.P$4 37.39,20.78 38.99,19.18 38.99,16.17 C18.2
N$24
  Top 0.203: U1.20 36.06,29.59 36.4,29.93 36.83,29.93 37.72,30.81 37.72,32.04 L1.2
  Top 0.254: C20.1 L1.2
N$25
  Top 0.254: L1.1 36.23,30.81 L2.1 35.56,30.14 U1.21
N$27
  Top 0.203: U1.11 39.36,25.41 40.03,24.74 JP2.2
N$28
  Top 0.254: U1.22 35.06,30.13 L2.2 L3.1
N$29
  Top 0.203: U1.13 39.11,26.41 39.98,27.28 JP3.2
N$30
  Top 0.203: U1.25 32.16,27.91 31.75,28.32 R9.2
N$31
  Top 0.254: L3.2 C22.2
N$32
  Top 0.254: C23.1 26.92,30.73 U$28.FEED | C22.1 27.18,30.73 U$28.FEED | 26.92,32.51 26.38,32.51 C24.1 26.42,32.38 27.05,31.75 U$28.FEED
N$33
  Top 0.203: C28.2 26.25,24.25 Y4.2 26.92,25.28 26.92,25.53 27.81,26.41 U1.28
N$34
  Top 0.203: JP4.2 39.02,27.69 39.02,27.16 38.77,26.91 U1.14
N$35
  Top 0.203: L5.2 L4.1
N$36
  Top 0.203: L5.1 32,23.15 32,23.62 32.79,24.41 U1.32
N$37
  Top 0.203: C29.2 24.47,28.5 Y4.1 25.13,27.29 25.13,27.52 25.31,27.7 26.84,27.7 27.62,26.91 U1.27
NRF-RST  (via drill 0.35)
  Top 0.203: U1.19 36.56,29.12 36.81,29.37 37.12,29.37 37.72,29.97 v38.99,29.97 | U2.26 11.85,23.57 v11.93,23.5 | v25.4,15.24 25.87,15.24 26.25,14.86 27.09,14.86 27.32,15.09 29.16,15.09 29.32,15.24 v32.38,15.24
  Bottom 0.203: v11.93,23.5 20.18,15.24 22.56,15.24 22.95,14.86 24.72,14.86 25.11,15.24 v25.4,15.24 | v32.38,15.24 38.1,20.95 40.64,20.95 42.57,22.89 42.57,23.11 42.67,23.21 42.67,28.45 41.15,29.97 v38.99,29.97
RDYN  (via drill 0.35)
  Top 0.203: U1.16 38.99,28.59 v38.99,28.7 | R10.1 23.98,17.97 U2.1
  Bottom 0.203: v38.99,28.7 30.73,28.7 28.83,26.8 28.83,21.72 24.55,17.44 R10.1
  other vias: 24.55,17.4
REQN  (via drill 0.35)
  Top 0.203: U1.12 39.47,25.91 v39.58,26.02 | v11.54,21 10.63,21 U2.29
  Bottom 0.203: v39.58,26.02 38.33,24.77 33.7,24.77 26.02,17.09 26.02,16.48 26.92,16.48 27.28,16.13 27.28,15.62 26.92,15.27 26.29,15.27 25.65,14.63 25.07,14.63 24.89,14.45 19.84,14.45 13.29,21 v11.54,21
RST
  Top 0.203: J3.5 14.73,33.02 20.32,33.02 21.59,31.75 21.59,29.84 20.57,28.83 19.88,28.83 19.65,28.6 19.65,27.9 19.52,27.77 U2.13
RTC-INT  (via drill 0.35)
  Top 0.203: R8.1 4.23,13.34 6.99,13.34 7.87,12.45 U6.7 | v13.97,18.41 13.97,27.66 U2.20
  Bottom 0.203: U6.7 8.28,12.33 8.28,14.22 8.68,14.62 10.73,14.62 13.97,17.85 v13.97,18.41
  other vias: 7.87,11.92
SCK  (via drill 0.35)
  Top 0.203: JP2.1 41.34,25.36 41.91,25.36 43.59,23.68 43.59,19.57 43.41,19.39 40.98,19.39 v40.01,18.41 | v22.31,32.47 22.03,32.47 19.44,35.06 9.93,35.06 8.79,33.92 8.79,32.88 10.03,31.64 J3.3 | U2.9 v22.06,24.36 21.26,24.36 21.05,24.16 20.98,24.16 v20.32,23.5 | v34.24,16.05 33.01,16.05 32.81,16.26 31.96,16.26 31.76,16.06 28.98,16.06 28.83,15.9 26.7,15.9 v26.67,15.88
  Bottom 0.203: v22.06,24.36 22.26,24.56 22.31,24.56 22.66,24.92 22.66,26.22 21.73,27.16 20,27.16 19.65,27.52 19.65,28.02 22.31,30.68 v22.31,32.47 | v34.24,16.05 34.52,16.05 34.67,15.9 37.49,15.9 v40.01,18.41 | v26.67,15.88 25.16,15.88 24.55,15.27 23.11,15.27 22.5,15.88 20.32,15.88 19.68,16.51 20.32,17.14 v20.32,23.5
SCL  (via drill 0.35)
  Top 0.203: U7.6 15.11,10.66 v14.61,10.16 | R7.2 6.31,27.18 JP1.1 9.65,29.21 14.65,29.21 15.46,28.41 U2.18 | v8.89,13.97 8.26,14.61 8.26,15.24 7.62,15.88 U4.14
  Bottom 0.203: SCL.MP 11.43,6.99 v14.61,10.16 10.16,10.16 9.14,11.18 U6.6 9.14,13.72 v8.89,13.97 | U4.14 5.71,17.59 5.71,25.27 JP1.1
  other vias: 9.14,11.92 7.43,15.88
SDA  (via drill 0.35)
  Top 0.203: 10.42,12.44 10.42,12.31 | R6.2 7.2,24.64 JP1.2 8.77,23.49 8.77,19.08 8.08,18.4 v8.08,18.21 | v11.43,12.06 10.57,12.06 U6.5 10.42,12.31 | 10.42,12.31 9.67,13.06 8.94,13.06 7.33,14.66 U4.13
  Bottom 0.203: v11.43,12.06 16.24,12.06 U7.5 16.39,10.67 14.86,9.14 SDA.MP | U2.19 13.92,27.77 13.31,28.38 11.36,28.38 JP1.2 | v8.08,18.21 8.08,15.48 U4.13
  other vias: 16.39,11.92 7.33,14.74 14.66,27.77
UD+
  Top 0.203: J2.D+1 37.55,7.7 38.1,8.26 38.95,8.26 R4.1
UD-
  Top 0.203: J2.D-1 36.9,7.85 R3.1
VBAT
  Top 0.406: 20.7,4.7 J4.1 | VBAT.MP 20.7,4.7 | 20.7,4.7 20.95,4.45 22.96,4.45 23.57,5.05 27.23,5.05 27.85,5.68 27.85,7.05 J1.1 28.94,8.26 | C8.1 27.03,10.85 27.61,10.85 28.94,9.52 28.94,8.26 | U3.3 31.61,10.86 31.48,10.73 31.42,10.73 28.94,8.26
VBAT-JMP
  Top 0.406: U5.3 22.3,13.58 21.84,13.58 21.6,13.34 21.6,12.31 21.84,12.07 22.3,12.07 U5.1 22.5,10.39 22.94,9.96 22.94,8.89 | 22.94,8.89 22.94,7.7 J4.2 | 22.94,8.89 23.5,9.45 24.42,9.45 24.84,9.87 24.84,10.45 24.38,10.91 C3.2
VUSB  (via drill 0.35)
  Top 0.203: v21.96,17.14 21.96,15.72 23.3,14.37 23.3,10.99 v24.13,10.16
  Top 0.406: J2.VBUS1 36.24,8.85 C1.1 36.28,10.66 U3.4
  Bottom 0.203: U3.4 34.23,10.86 v31.67,13.43 31.43,13.18 31.43,11.72 29.86,10.16 v24.13,10.16 | v21.96,17.14 21.96,18.75 21.42,19.29 21.42,22.13 U2.7
  other vias: 36.48,10.86 22.06,22.77